# Altium schematic sheet LAN9254_D_P2.SchDoc
size 431 x 279 mm; DocumentNumber: 17; SheetNumber: 11; SheetTotal: 13
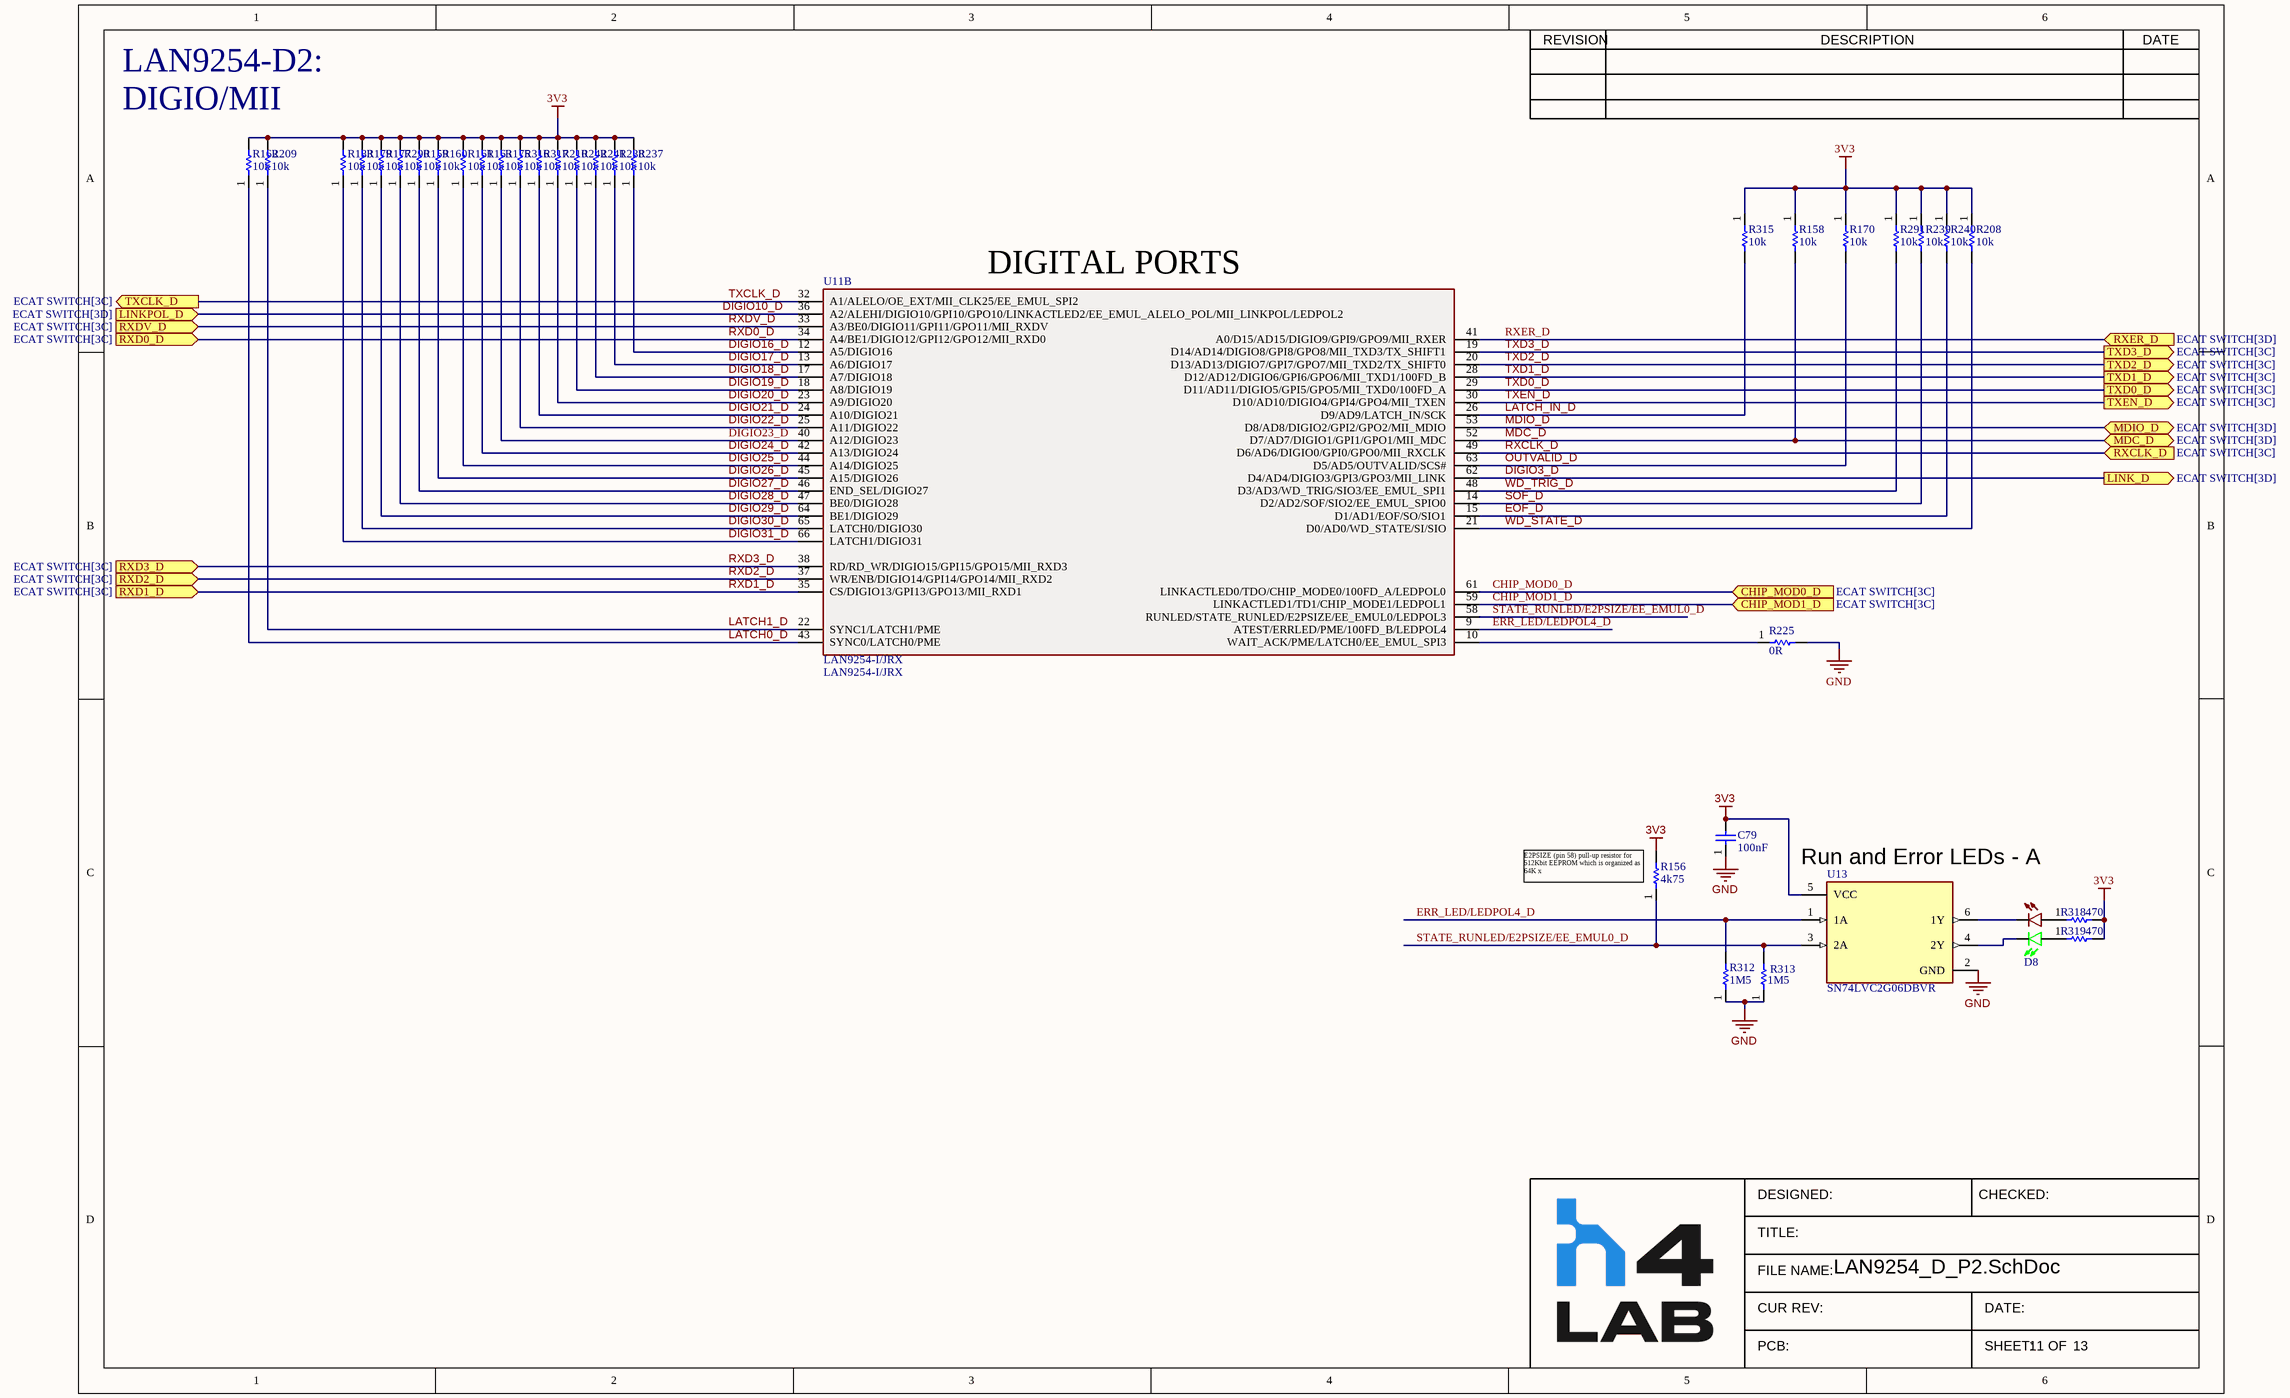
[diagram p0: LAN9254_D_P2.SchDoc]

## Parts
C79  value 100nF  [CAPC1005X03N(0402)]  (hidden comment: GRM155R71C104JA88D)
D8  LTST-C195KGJRKT  [Dual_LED]  (value not drawn)
R156  value 4k75  [RESC1005X06N(0402)]  (hidden comment: RC0402FR-074K75L)
R158  value 10k  [RESC1005X06N(0402)]  (hidden comment: RC0402FR-0710KL)
R159  value 10k  [RESC1005X06N(0402)]  (hidden comment: RC0402FR-0710KL)
R160  value 10k  [RESC1005X06N(0402)]  (hidden comment: RC0402FR-0710KL)
R161  value 10k  [RESC1005X06N(0402)]  (hidden comment: RC0402FR-0710KL)
R162  value 10k  [RESC1005X06N(0402)]  (hidden comment: RC0402FR-0710KL)
R163  value 10k  [RESC1005X06N(0402)]  (hidden comment: RC0402FR-0710KL)
R170  value 10k  [RESC1005X06N(0402)]  (hidden comment: RC0402FR-0710KL)
R175  value 10k  [RESC1005X06N(0402)]  (hidden comment: RC0402FR-0710KL)
R177  value 10k  [RESC1005X06N(0402)]  (hidden comment: RC0402FR-0710KL)
R179  value 10k  [RESC1005X06N(0402)]  (hidden comment: RC0402FR-0710KL)
R183  value 10k  [RESC1005X06N(0402)]  (hidden comment: RC0402FR-0710KL)
R208  value 10k  [RESC1005X06N(0402)]  (hidden comment: RC0402FR-0710KL)
R209  value 10k  [RESC1005X06N(0402)]  (hidden comment: RC0402FR-0710KL)
R210  value 10k  [RESC1005X06N(0402)]  (hidden comment: RC0402FR-0710KL)
R225  value 0R  [0402]  (hidden comment: RCS04020000Z0ED)
R237  value 10k  [RESC1005X06N(0402)]  (hidden comment: RC0402FR-0710KL)
R238  value 10k  [RESC1005X06N(0402)]  (hidden comment: RC0402FR-0710KL)
R239  value 10k  [RESC1005X06N(0402)]  (hidden comment: RC0402FR-0710KL)
R240  value 10k  [RESC1005X06N(0402)]  (hidden comment: RC0402FR-0710KL)
R241  value 10k  [RESC1005X06N(0402)]  (hidden comment: RC0402FR-0710KL)
R242  value 10k  [RESC1005X06N(0402)]  (hidden comment: RC0402FR-0710KL)
R290  value 10k  [RESC1005X06N(0402)]  (hidden comment: RC0402FR-0710KL)
R291  value 10k  [RESC1005X06N(0402)]  (hidden comment: RC0402FR-0710KL)
R312  value 1M5  [0402]  (hidden comment: CRCW04021M50JNED)
R313  value 1M5  [0402]  (hidden comment: CRCW04021M50JNED)
R315  value 10k  [RESC1005X06N(0402)]  (hidden comment: RC0402FR-0710KL)
R316  value 10k  [RESC1005X06N(0402)]  (hidden comment: RC0402FR-0710KL)
R317  value 10k  [RESC1005X06N(0402)]  (hidden comment: RC0402FR-0710KL)
R318  value 470  [0402]  (hidden comment: CRCW0402470RJNED)
R319  value 470  [0402]  (hidden comment: CRCW0402470RJNED)
U11  LAN9254-I/JRX  [QFP50P1400X1400X120-81N]  (part B of 2)
U13  SN74LVC2G06DBVR  [FP-DBV0006A-IPC_C]

## Ports
CHIP_MOD0_D (in, see ECAT SWITCH[3C]), CHIP_MOD1_D (in, see ECAT SWITCH[3C]), LINK_D (out, see ECAT SWITCH[3D]), LINKPOL_D (in, see ECAT SWITCH[3D]), MDC_D (bidir, see ECAT SWITCH[3D]), MDIO_D (bidir, see ECAT SWITCH[3D]), RXCLK_D (in, see ECAT SWITCH[3C]), RXD0_D (in, see ECAT SWITCH[3C]), RXD1_D (in, see ECAT SWITCH[3C]), RXD2_D (in, see ECAT SWITCH[3C]), RXD3_D (in, see ECAT SWITCH[3C]), RXDV_D (in, see ECAT SWITCH[3C]), RXER_D (in, see ECAT SWITCH[3D]), TXCLK_D (out, see ECAT SWITCH[3C]), TXD0_D (out, see ECAT SWITCH[3C]), TXD1_D (out, see ECAT SWITCH[3C]), TXD2_D (out, see ECAT SWITCH[3C]), TXD3_D (out, see ECAT SWITCH[3C]), TXEN_D (out, see ECAT SWITCH[3C])

## Nets
3V3: C79.2 R156.2 R158.1 R159.2 R160.2 R161.2 R162.2 R163.2 R170.1 R175.2 R177.2 R179.2 R183.2 R208.1 R209.2 R210.2 R237.2 R238.2 R239.1 R240.1 R241.2 R242.2 R290.2 R291.1 R315.1 R316.2 R317.2 R318.2 R319.2 U13.5(VCC)
GND: C79.1 R225.2 R312.1 R313.1 U13.2(GND)
CHIP_MOD0_D: U11.61(LINKACTLED0/TDO/CHIP_MODE0/100FD_A/LEDPOL0) ; port CHIP_MOD0_D
CHIP_MOD1_D: U11.59(LINKACTLED1/TD1/CHIP_MODE1/LEDPOL1) ; port CHIP_MOD1_D
DIGIO3_D: U11.62(D4/AD4/DIGIO3/GPI3/GPO3/MII_LINK) ; port LINK_D
DIGIO10_D: U11.36(A2/ALEHI/DIGIO10/GPI10/GPO10/LINKACTLED2/EE_EMUL_ALELO_POL/MII_LINKPOL/LEDPOL2) ; port LINKPOL_D
DIGIO16_D: R237.1 U11.12(A5/DIGIO16)
DIGIO17_D: R238.1 U11.13(A6/DIGIO17)
DIGIO18_D: R241.1 U11.17(A7/DIGIO18)
DIGIO19_D: R242.1 U11.18(A8/DIGIO19)
DIGIO20_D: R210.1 U11.23(A9/DIGIO20)
DIGIO21_D: R317.1 U11.24(A10/DIGIO21)
DIGIO22_D: R316.1 U11.25(A11/DIGIO22)
DIGIO23_D: R175.1 U11.40(A12/DIGIO23)
DIGIO24_D: R163.1 U11.42(A13/DIGIO24)
DIGIO25_D: R161.1 U11.44(A14/DIGIO25)
DIGIO26_D: R160.1 U11.45(A15/DIGIO26)
DIGIO27_D: R159.1 U11.46(END_SEL/DIGIO27)
DIGIO28_D: R290.1 U11.47(BE0/DIGIO28)
DIGIO29_D: R177.1 U11.64(BE1/DIGIO29)
DIGIO30_D: R179.1 U11.65(LATCH0/DIGIO30)
DIGIO31_D: R183.1 U11.66(LATCH1/DIGIO31)
EOF_D: R240.2 U11.15(D1/AD1/EOF/SO/SIO1)
ERR_LED/LEDPOL4_D: R312.2 U11.9(ATEST/ERRLED/PME/100FD_B/LEDPOL4) U13.1(1A)
LATCH0_D: R162.1 U11.43(SYNC0/LATCH0/PME)
LATCH1_D: R209.1 U11.22(SYNC1/LATCH1/PME)
LATCH_IN_D: R315.2 U11.26(D9/AD9/LATCH_IN/SCK)
MDC_D: R158.2 U11.52(D7/AD7/DIGIO1/GPI1/GPO1/MII_MDC) ; port MDC_D
MDIO_D: U11.53(D8/AD8/DIGIO2/GPI2/GPO2/MII_MDIO) ; port MDIO_D
OUTVALID_D: R170.2 U11.63(D5/AD5/OUTVALID/SCS#)
RXCLK_D: U11.49(D6/AD6/DIGIO0/GPI0/GPO0/MII_RXCLK) ; port RXCLK_D
RXD0_D: U11.34(A4/BE1/DIGIO12/GPI12/GPO12/MII_RXD0) ; port RXD0_D
RXD1_D: U11.35(CS/DIGIO13/GPI13/GPO13/MII_RXD1) ; port RXD1_D
RXD2_D: U11.37(WR/ENB/DIGIO14/GPI14/GPO14/MII_RXD2) ; port RXD2_D
RXD3_D: U11.38(RD/RD_WR/DIGIO15/GPI15/GPO15/MII_RXD3) ; port RXD3_D
RXDV_D: U11.33(A3/BE0/DIGIO11/GPI11/GPO11/MII_RXDV) ; port RXDV_D
RXER_D: U11.41(A0/D15/AD15/DIGIO9/GPI9/GPO9/MII_RXER) ; port RXER_D
SOF_D: R239.2 U11.14(D2/AD2/SOF/SIO2/EE_EMUL_SPIO0)
STATE_RUNLED/E2PSIZE/EE_EMUL0_D: R156.1 R313.2 U11.58(RUNLED/STATE_RUNLED/E2PSIZE/EE_EMUL0/LEDPOL3) U13.3(2A)
TXCLK_D: U11.32(A1/ALELO/OE_EXT/MII_CLK25/EE_EMUL_SPI2) ; port TXCLK_D
TXD0_D: U11.29(D11/AD11/DIGIO5/GPI5/GPO5/MII_TXD0/100FD_A) ; port TXD0_D
TXD1_D: U11.28(D12/AD12/DIGIO6/GPI6/GPO6/MII_TXD1/100FD_B) ; port TXD1_D
TXD2_D: U11.20(D13/AD13/DIGIO7/GPI7/GPO7/MII_TXD2/TX_SHIFT0) ; port TXD2_D
TXD3_D: U11.19(D14/AD14/DIGIO8/GPI8/GPO8/MII_TXD3/TX_SHIFT1) ; port TXD3_D
TXEN_D: U11.30(D10/AD10/DIGIO4/GPI4/GPO4/MII_TXEN) ; port TXEN_D
WD_STATE_D: R208.2 U11.21(D0/AD0/WD_STATE/SI/SIO)
WD_TRIG_D: R291.2 U11.48(D3/AD3/WD_TRIG/SIO3/EE_EMUL_SPI1)
NetD8_1: D8.1 R319.1
NetD8_2: D8.2 R318.1
NetD8_3: D8.3 U13.4(2Y)
NetD8_4: D8.4 U13.6(1Y)
NetR225_1: R225.1 U11.10(WAIT_ACK/PME/LATCH0/EE_EMUL_SPI3)

## Notes on the sheet
- LAN9254-D2:
- DIGIO/MII
- (near U11) DIGITAL PORTS
- (near R156) E2PSIZE (pin 58) pull-up resistor for 512Kbit EEPROM which is organized as 64K x
- (near U13) Run and Error LEDs - A
- REVISION
- DESCRIPTION
- DATE
- DESIGNED:
- CHECKED:
- TITLE:
- FILE NAME:
- CUR REV:
- PCB:
- SHEET:
- DATE:
- OF

## Library data of the parts
C79 = 100nF_16V_0402_CAP: CAP CER 0.1UF 16V X7R 0402; Tolerance: 5%; MPN: GRM155R71C104JA88D; Voltage Rating: 16V; Temp Coeff: X7R; Size/Package: 0402
D8 = Green/Red_LED: LED GREEN/RED CLEAR CHIP SMD; Color: Green, Red; Voltage Vf: 2V Green, 2V Red; Current If: 20mA. 20mA; MPN: LTST-C195KGJRKT; Mounting Type: SMD; Supplier 1: Digi-Key; Supplier Part Number 1: 160-1452-1-ND
R156 = 4k75_1/16_0402_RES: RES SMD 4.75K OHM 1% 1/16W 0402; Power: 1/16; MPN: RC0402FR-074K75L; Tolerance: 1%; Package/Case: 0402
R158-R163 R170 R175 R177 R179 R183 R208-R210 R237-R242 R290 R291 R315-R317 = 10k_1/16W_0402_RES: RES SMD 10K OHM 1% 1/16W 0402; MPN: RC0402FR-0710KL; Tolerance: 1%; Power: 1/16W; Size: 0402
R225 = 0R_1/5W_0402_RCS04020000Z0ED_RES: VISHAY - RCS04020000Z0ED - SMD Chip Resistor, 0402 [1005 Metric], 0 ohm, RCS Series, 50 V, Thick Film, 200 mW; Manufacturer: Vishay Dale; Resistance: 0mR; Max Power Dissipation: 200mW; Supplier 1: Digi-Key; Supplier Part Number 1: 541-2877-1-ND; Manufacturer Part Number: RCS04020000Z0ED; RoHS: Yes; Category: Chip SMD Resistors; Stock 1: 18214; Pricing 1: 1=0.10000, 10=0.08300, 25=0.05760, 50=0.04480, 100=0.03200, 250=0.02496, 500=0.01984, 1000=0.01408, 5000=0.01088 (USD); Case/Package: 0402; Case Code (Metric): 1005; Case Code (Imperial): 0402; Min Operating Temperature: -55°C; Max Operating Temperature: 155°C; Packaging: Tape and Reel; Resistor Type: Thick Film; Number of Terminations: 2; Features: Automotive AEC-Q200; Length: 0.039inch; Width: 0.02inch; Height: 0.016inch; RoHS Compliant: Yes; ComponentLink1URL: http://www.farnell.com/datasheets/2618474.pdf?src-supplier=Farnell; ComponentLink1Description: http://www.farnell.com/datasheets/2618474.pdf?src-supplier=Farnell; ComponentLink2URL: http://www.vishay.com/docs/20065/rcse3.pdf?src-supplier=Digi-Key; ComponentLink2Description: http://www.vishay.com/docs/20065/rcse3.pdf?src-supplier=Digi-Key; ComponentLink3URL: http://www.farnell.com/datasheets/2618474.pdf?src-supplier=Element14; ComponentLink3Description: http://www.farnell.com/datasheets/2618474.pdf?src-supplier=Element14; ComponentLink4URL: http://www.farnell.com/datasheets/2618474.pdf?src-supplier=Newark; ComponentLink4Description: http://www.farnell.com/datasheets/2618474.pdf?src-supplier=Newark
R312 R313 = 1M5_1/16W_0402_CRCW04021M50JNED_RES: RES SMD 1.5M OHM 5% 1/16W 0402; Manufacturer: Vishay Dale; Resistance: 1.5MR; Power Rating: 63mW; Voltage Rating: 50V; Temperature Coefficient: 200ppm/°C; Supplier 1: Digi-Key; Manufacturer Part Number: CRCW04021M50JNED; RoHS: Yes; Category: Chip SMD Resistors; Stock 1: 7870; Pricing 1: 1=0,10000, 10=0,03300, 100=0,01360, 1000=0,00610, 2500=0,00529, 5000=0,00437 (USD); Case/Package: 0402; Weight: 2.3E-05oz; Case Code (Imperial): 0402; Case Code (Metric): 1005; Contact Plating: Tin; Min Operating Temperature: -55°C; Max Operating Temperature: 155°C; Tolerance: 5%; Package Quantity: 1; Packaging: Tape and Reel; Termination: SMD/SMT; Resistor Type: Thick Film; Number of Terminations: 2; Max Power Dissipation: 63mW; Voltage Rating (DC): 50V; Features: Automotive AEC-Q200; Series: CRCW; Construction: Rectangular; Length: 1mm; Width: 0.5mm; Height: 0.016inch; Depth: 0.5mm; Radiation Hardening: No; RoHS Compliant: Yes; Military Standard: Not; Lead Free: Lead Free; ComponentLink1URL: https://datasheet.ciiva.com/9100/dcrcwe3-9100251.pdf?src-supplier=Avnet; ComponentLink1Description: https://datasheet.ciiva.com/9100/dcrcwe3-9100251.pdf?src-supplier=Avnet; ComponentLink2URL: https://datasheet.ciiva.com/2493/dcrcwe3-2493529.pdf?src-supplier=Digi-Key; ComponentLink2Description: https://datasheet.ciiva.com/2493/dcrcwe3-2493529.pdf?src-supplier=Digi-Key; ComponentLink3URL: https://datasheet.ciiva.com/2493/dcrcwe3-2493530.pdf?src-supplier=Digi-Key; ComponentLink3Description: https://datasheet.ciiva.com/2493/dcrcwe3-2493530.pdf?src-supplier=Digi-Key; ComponentLink4URL: https://datasheet.ciiva.com/2493/dcrcwe3-2493531.pdf?src-supplier=Digi-Key; ComponentLink4Description: https://datasheet.ciiva.com/2493/dcrcwe3-2493531.pdf?src-supplier=Digi-Key; Supplier Part Number 1: 541-1.5MJCT-ND
R318 R319 = 470_1/10W_0402_CRCW0402470RJNED: Vishay CRCW Series Thick Film Resistor 0402 Case 470 5% 0.063W 200ppm/K; Manufacturer: Vishay Dale; Resistance: 470R; Max Power Dissipation: 63mW; Temperature Coefficient: 200ppm/°C; Voltage Rating: 50V; Supplier 1: Digi-Key; Manufacturer Part Number: CRCW0402470RJNED; RoHS: Yes; Category: Chip SMD Resistors; Pricing 1: 1=0,10000, 10=0,03300, 100=0,01360, 1000=0,00610, 2500=0,00529, 5000=0,00437 (USD); Case/Package: 0402; Number of Pins: 2; Weight: 2.3E-05oz; Case Code (Metric): 1005; Case Code (Imperial): 0402; Contact Plating: Tin; Min Operating Temperature: -55°C; Max Operating Temperature: 155°C; Packaging: Tape and Reel; Tolerance: 5%; Package Quantity: 1; Resistor Type: Thick Film; Number of Terminations: 2; Features: Automotive AEC-Q200; Power Rating: 63mW; Termination: SMD/SMT; Series: CRCW; Voltage Rating (DC): 50V; Resistance Tolerance: 5%; Construction: Rectangular; Technology: THICK FILM; Length: 1mm; Width: 0.02inch; Height: 0.35mm; Depth: 0.5mm; Radiation Hardening: No; RoHS Compliant: Yes; Lead Free: Lead Free; Military Standard: Not; REACH SVHC: Unknown; ComponentLink1URL: https://datasheet.ciiva.com/2461/dcrcwe3-2461992.pdf?src-supplier=Digi-Key; ComponentLink1Description: https://datasheet.ciiva.com/2461/dcrcwe3-2461992.pdf?src-supplier=Digi-Key; ComponentLink2URL: https://datasheet.ciiva.com/2461/dcrcwe3-2461993.pdf?src-supplier=Digi-Key; ComponentLink2Description: https://datasheet.ciiva.com/2461/dcrcwe3-2461993.pdf?src-supplier=Digi-Key; ComponentLink3URL: https://datasheet.ciiva.com/2461/dcrcwe3-2461994.pdf?src-supplier=Digi-Key; ComponentLink3Description: https://datasheet.ciiva.com/2461/dcrcwe3-2461994.pdf?src-supplier=Digi-Key; ComponentLink4URL: https://datasheet.ciiva.com/5550/dcrcwe3-109170-5550440.pdf?src-supplier=Mouser; ComponentLink4Description: https://datasheet.ciiva.com/5550/dcrcwe3-109170-5550440.pdf?src-supplier=Mouser; ComponentLink5URL: https://datasheet.ciiva.com/3256/dcrcwe3-3256554.pdf?src-supplier=Avnet; ComponentLink5Description: https://datasheet.ciiva.com/3256/dcrcwe3-3256554.pdf?src-supplier=Avnet; ComponentLink6URL: https://datasheet.ciiva.com/8336/dcrcwe3-8336717.pdf?src-supplier=Avnet; ComponentLink6Description: https://datasheet.ciiva.com/8336/dcrcwe3-8336717.pdf?src-supplier=Avnet; ComponentLink7URL: https://datasheet.ciiva.com/28571/1847332-28571880.pdf?src-supplier=Element14; ComponentLink7Description: https://datasheet.ciiva.com/28571/1847332-28571880.pdf?src-supplier=Element14; Supplier Part Number 1: 541-470JDKR-ND
U11 = LAN9254-I/JRX: 2/3-PORT Ethercat Slave Controller With 32 Digios With Integrated Ethernet Phys; Manufacturer: Microchip; Supplier 1: Digi-Key; Manufacturer Part Number: LAN9254-I/JRX; RoHS: Yes; Pricing 1: 1=14.24000, 25=12.99000 (USD); RoHS Compliant: Yes; Supplier Part Number 1: 150-LAN9254-I/JRX-ND
U13 = BUF_dual_SN74LVC2G06DBVR: Buffer/Driver 2-CH Inverting Open Drain CMOS 6-Pin SOT-23 T/R; Manufacturer: Texas Instruments; Number of Channels: 2; Propagation Delay: 2.9ns; Min Supply Voltage: 1.65V; High Level Output Current: 32mA; Logic Function: Buffer; Max Supply Voltage: 5.5V; Nominal Supply Current: 40mA; Turn-On Delay Time: 7.2ns; Quiescent Current: 10uA; Number of Inputs: 1; Height: 1.15mm; Radiation Hardening: No; Length: 2.9mm; Number of Output Lines: 2; Package Quantity: 3000; Min Operating Temperature: -40°C; Case/Package: SOT-23; REACH SVHC: No SVHC; Number of Elements: 2; Number of Pins: 6; Mount: Surface Mount; Polarity: Inverting; Contact Plating: Gold; Number of Input Lines: 2; Number of Outputs: 2; Number of Circuits: 2; Number of Gates: 2; Max Operating Temperature: 125°C; RoHS Compliant: Yes; Low Level Output Current: 32mA; Number of Bits: 2; Width: 1.6mm; Packaging: Tape and Reel; Lead Free: Lead Free; Supplier 1: Digi-Key; Manufacturer Part Number: SN74LVC2G06DBVR; RoHS: Yes; Category: Logic Gates; Stock 1: 3468; Pricing 1: 1=0,47000, 10=0,35600, 25=0,32080, 100=0,22150, 250=0,18656, 500=0,15158, 1000=0,11660 (USD); ComponentLink1URL: https://datasheet.ciiva.com/22719/1737061-22719510.pdf?src-supplier=Element14; ComponentLink1Description: https://datasheet.ciiva.com/22719/1737061-22719510.pdf?src-supplier=Element14; ComponentLink2URL: https://datasheet.ciiva.com/7293/sn74lvc2g06-7293674.pdf?src-supplier=Newark; ComponentLink2Description: https://datasheet.ciiva.com/7293/sn74lvc2g06-7293674.pdf?src-supplier=Newark; ComponentLink3URL: https://datasheet.ciiva.com/46439/1786796-46439655.pdf?src-supplier=Element14; ComponentLink3Description: https://datasheet.ciiva.com/46439/1786796-46439655.pdf?src-supplier=Element14; ComponentLink4URL: https://datasheet.ciiva.com/1864/sn74lvc2g06-1864312.pdf?src-supplier=Digi-Key; ComponentLink4Description: https://datasheet.ciiva.com/1864/sn74lvc2g06-1864312.pdf?src-supplier=Digi-Key; ComponentLink5URL: https://datasheet.ciiva.com/1864/sn74lvc2g06-1864311.pdf?src-supplier=Digi-Key; ComponentLink5Description: https://datasheet.ciiva.com/1864/sn74lvc2g06-1864311.pdf?src-supplier=Digi-Key; ComponentLink6URL: https://datasheet.ciiva.com/1864/sn74lvc2g06-1864313.pdf?src-supplier=Digi-Key; ComponentLink6Description: https://datasheet.ciiva.com/1864/sn74lvc2g06-1864313.pdf?src-supplier=Digi-Key; ComponentLink7URL: https://datasheet.ciiva.com/14301/sn74lvc2g06-14301182.pdf?src-supplier=Avnet; ComponentLink7Description: https://datasheet.ciiva.com/14301/sn74lvc2g06-14301182.pdf?src-supplier=Avnet; ComponentLink8URL: https://datasheet.ciiva.com/26220/sn74lvc2g06-26220937.pdf?src-supplier=Avnet+Europe; ComponentLink8Description: https://datasheet.ciiva.com/26220/sn74lvc2g06-26220937.pdf?src-supplier=Avnet+Europe; Supplier Part Number 1: 296-13492-1-ND